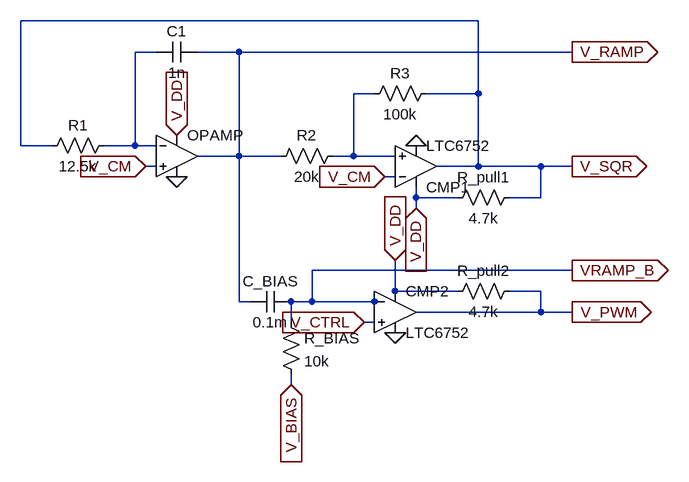
[diagram p0: schematic p1_instance.asc]
p1_instance.asc, the LTspice schematic file:
Version 4.1
SHEET 1 880 680
WIRE -64 -512 -768 -512
WIRE -560 -464 -592 -464
WIRE -432 -464 -496 -464
WIRE 80 -464 -432 -464
WIRE -224 -400 -256 -400
WIRE -64 -400 -64 -512
WIRE -64 -400 -144 -400
WIRE -768 -320 -768 -512
WIRE -720 -320 -768 -320
WIRE -592 -320 -592 -464
WIRE -592 -320 -640 -320
WIRE -560 -320 -592 -320
WIRE -432 -304 -432 -464
WIRE -432 -304 -496 -304
WIRE -368 -304 -432 -304
WIRE -256 -304 -256 -400
WIRE -256 -304 -288 -304
WIRE -192 -304 -256 -304
WIRE -560 -288 -576 -288
WIRE -64 -288 -64 -400
WIRE -64 -288 -128 -288
WIRE 32 -288 -64 -288
WIRE 80 -288 32 -288
WIRE -192 -272 -208 -272
WIRE -160 -240 -160 -256
WIRE -96 -240 -160 -240
WIRE 32 -240 32 -288
WIRE 32 -240 -16 -240
WIRE -160 -224 -160 -240
WIRE 80 -128 -320 -128
WIRE -192 -96 -192 -144
WIRE -96 -96 -192 -96
WIRE 32 -96 -16 -96
WIRE -432 -80 -432 -304
WIRE -416 -80 -432 -80
WIRE -320 -80 -320 -128
WIRE -320 -80 -352 -80
WIRE -224 -80 -320 -80
WIRE -208 -80 -224 -80
WIRE 32 -64 32 -96
WIRE 32 -64 -160 -64
WIRE 80 -64 32 -64
WIRE -352 -48 -352 -80
WIRE -224 -48 -240 -48
WIRE -352 48 -352 32
FLAG 80 -64 V_PWM
IOPIN 80 -64 Out
FLAG 80 -464 V_RAMP
IOPIN 80 -464 Out
FLAG 80 -288 V_SQR
IOPIN 80 -288 Out
FLAG -352 48 V_BIAS
IOPIN -352 48 In
FLAG -240 -48 V_CTRL
IOPIN -240 -48 In
FLAG -208 -272 V_CM
IOPIN -208 -272 In
FLAG -576 -288 V_CM
IOPIN -576 -288 In
FLAG -528 -336 V_DD
IOPIN -528 -336 In
FLAG -192 -144 V_DD
IOPIN -192 -144 In
FLAG -528 -272 0
FLAG -160 -320 0
FLAG -192 -32 0
FLAG -160 -224 V_DD
IOPIN -160 -224 In
FLAG 80 -128 VRAMP_B
IOPIN 80 -128 Out
SYMBOL Comparators\\LTC6752 -160 -224 M180
SYMATTR InstName CMP1
SYMBOL Comparators\\LTC6752 -192 -128 R0
SYMATTR InstName CMP2
SYMBOL res -624 -336 R90
WINDOW 0 0 56 VBottom 2
WINDOW 3 32 56 VTop 2
SYMATTR InstName R1
SYMATTR Value 12.5k
SYMBOL res -272 -320 R90
WINDOW 0 0 56 VBottom 2
WINDOW 3 32 56 VTop 2
SYMATTR InstName R2
SYMATTR Value 20k
SYMBOL res -128 -416 R90
WINDOW 0 0 56 VBottom 2
WINDOW 3 32 56 VTop 2
SYMATTR InstName R3
SYMATTR Value 100k
SYMBOL cap -496 -480 R90
WINDOW 0 0 32 VBottom 2
WINDOW 3 32 32 VTop 2
SYMATTR InstName C1
SYMATTR Value 1n
SYMBOL cap -352 -96 R90
WINDOW 0 0 32 VBottom 2
WINDOW 3 32 32 VTop 2
SYMATTR InstName C_BIAS
SYMATTR Value 0.1m
SYMBOL res -368 -64 R0
SYMATTR InstName R_BIAS
SYMATTR Value 10k
SYMBOL res 0 -256 R90
WINDOW 0 0 56 VBottom 2
WINDOW 3 32 56 VTop 2
SYMATTR InstName R_pull1
SYMATTR Value 4.7k
SYMBOL res 0 -112 R90
WINDOW 0 0 56 VBottom 2
WINDOW 3 32 56 VTop 2
SYMATTR InstName R_pull2
SYMATTR Value 4.7k
SYMBOL OpAmps\\UniversalOpAmp2 -528 -304 R0
SYMATTR InstName OPAMP

The netlist it stands for:
* p1_instance.asc
X§CMP1 N002 V_CM V_DD 0 V_SQR LTC6752  ; pins In+ In- V+ V- OUT
X§CMP2 V_CTRL VRAMP_B V_DD 0 V_PWM LTC6752  ; pins In+ In- V+ V- OUT
R1 N001 V_SQR 12.5k
R2 N002 V_RAMP 20k
R3 V_SQR N002 100k
C1 V_RAMP N001 1n
C_BIAS VRAMP_B V_RAMP 0.1m
R_BIAS VRAMP_B V_BIAS 10k
R_pull1 V_SQR V_DD 4.7k
R_pull2 V_PWM V_DD 4.7k
X§OPAMP V_CM N001 V_DD 0 V_RAMP level2 Avol=1Meg GBW=10Meg Slew=10Meg Ilimit=25m Rail=0 Vos=0 En=0 Enk=0 In=0 Ink=0 Rin=500Meg  ; pins In+ In- V+ V- OUT
.lib LTC7.lib
.lib UniversalOpAmp2.lib
.backanno
.end